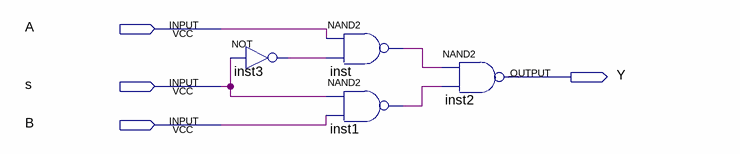
[diagram p0: schematic sheet]
// Quartus schematic lab3_g8_p1.bdf as structural Verilog: 4 symbols, 4 pins
module lab3_g8_p1 (
  input  A,
  input  s,
  input  B,
  output Y
);

  wire inst1_out, inst3_out, inst_out;

  not inst3 (inst3_out, s);
  nand inst (inst_out, A, inst3_out);
  nand inst1 (inst1_out, s, B);
  nand inst2 (Y, inst_out, inst1_out);
endmodule
